# EasyEDA Pro project Xbee_v2.eprj

# Schematic Schematic1

## Sheets
1 Xbee: Board Name: Board1; Create Date: 2024-11-14; Page Name: Xbee; Project Name: Xbee_v2; Schematic Name: Schematic1; Update Date: 2024-12-07; Company: EasyEDA.com; Drawn: EasyEDA; Page Size: A4; Part Number: JLCPCB-002; Reviewed: EasyEDA; Version: V0.1
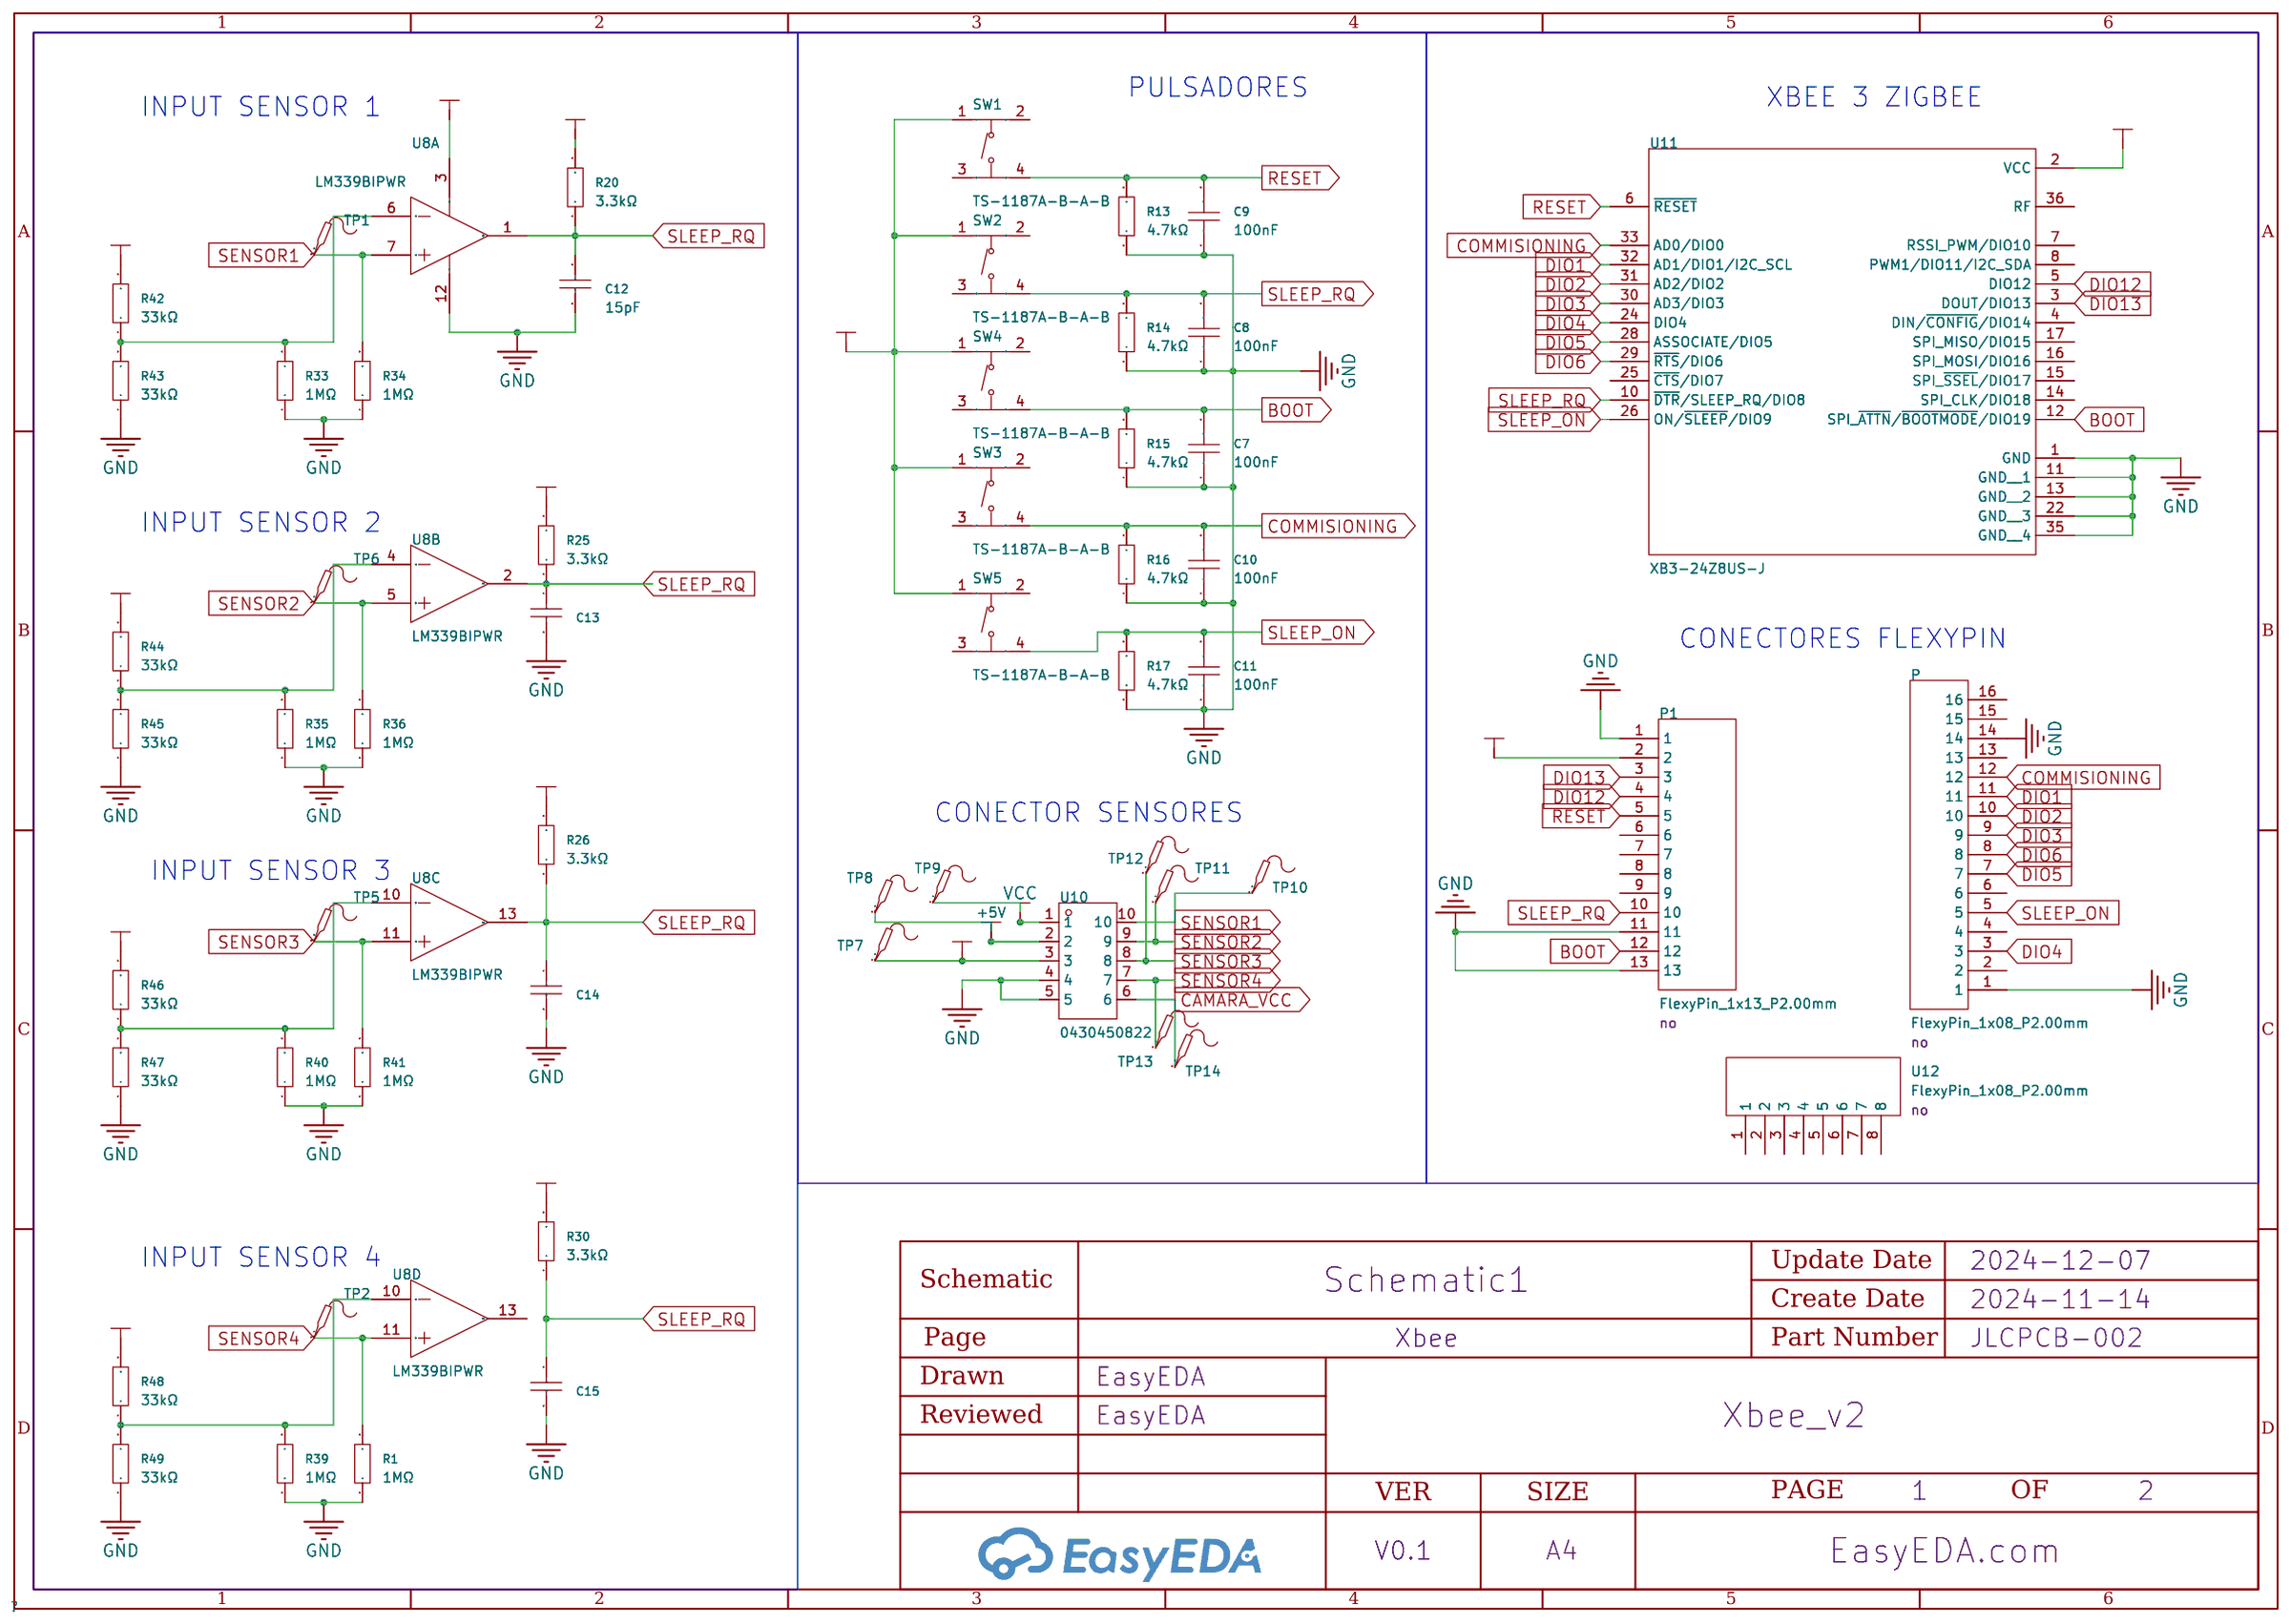
[diagram p0: Xbee]
2 Power: Create Date: 2024-11-18; Page Name: Power; Update Date: 2024-11-24
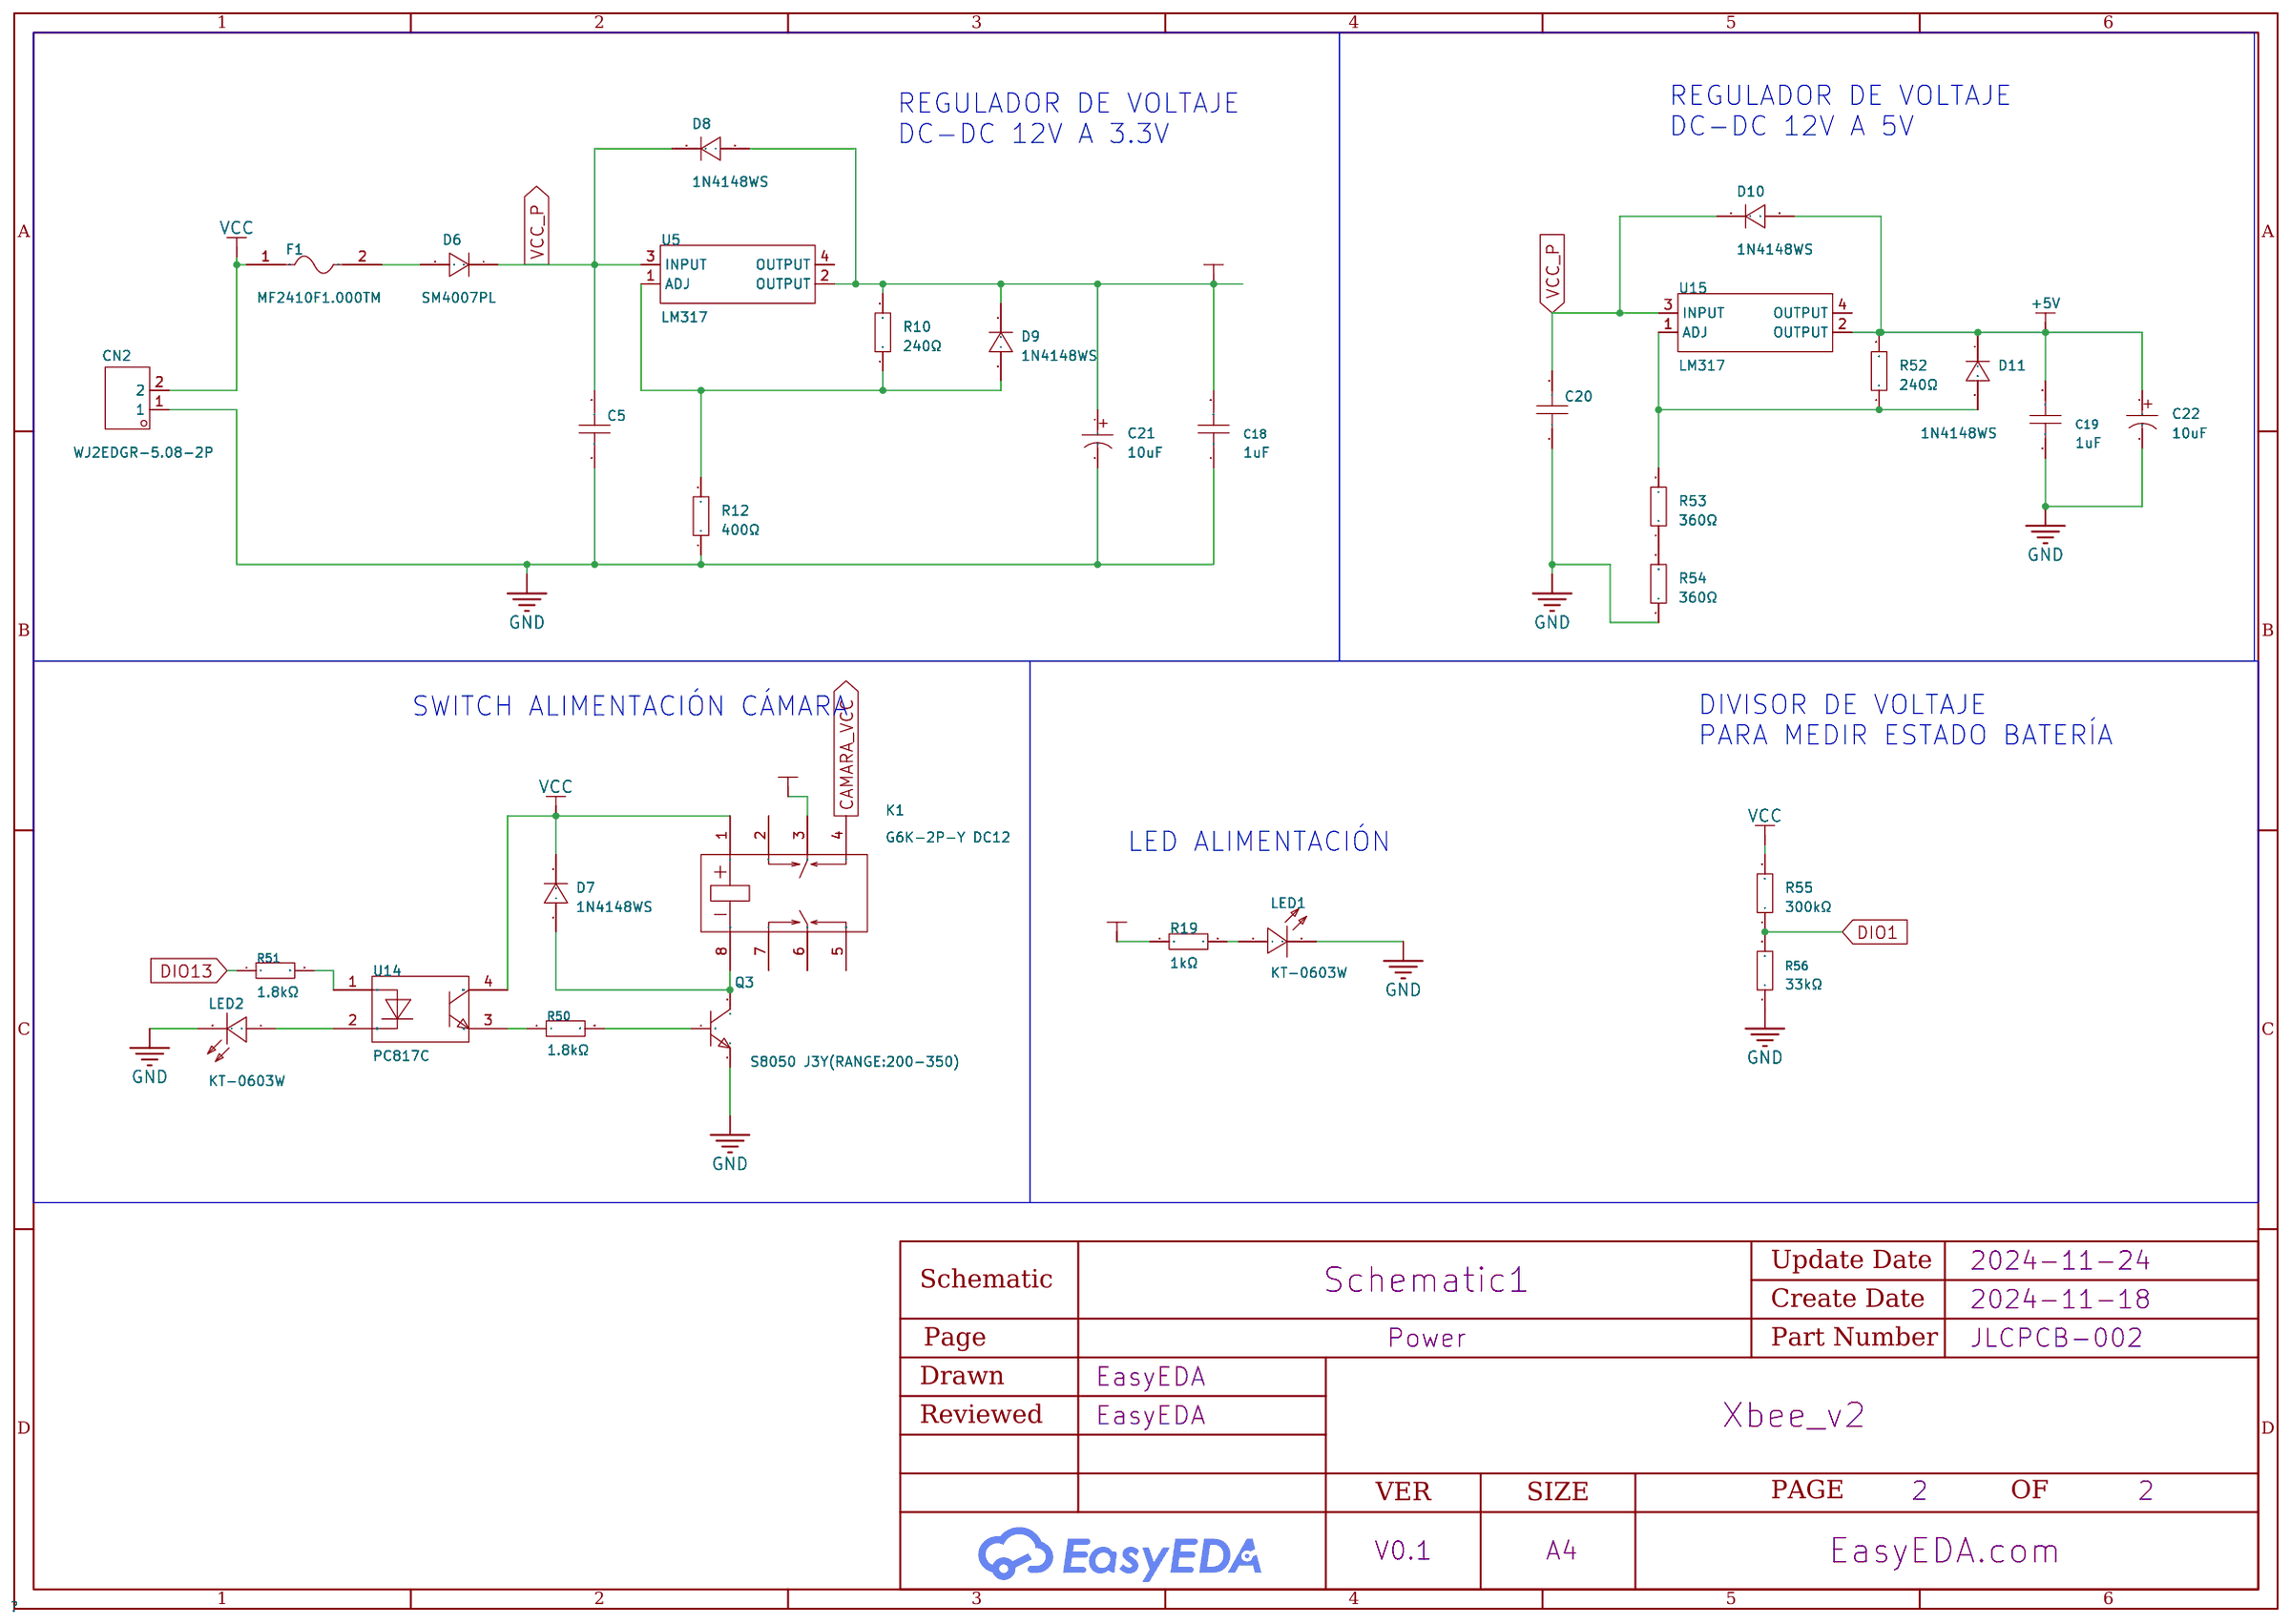
[diagram p1: Power]

## Parts
sheet Power
C5  100nF  [C0603]
C18  1uF  [C0603]
C19  1uF  [C0603]
C20  100nF  [C0603]
C21  10uF  [CAP-SMD_BD6.3-L6.6-W6.6-FD]
C22  10uF  [CAP-SMD_BD6.3-L6.6-W6.6-FD]
CN2  WJ2EDGR-5.08-2P  [CONN-TH_WJ2EDGR-5.08-2P]
D6  SM4007PL  [SOD-123F_L2.8-W1.8-LS3.7-RD]
D7  1N4148WS  [SOD-323_L1.8-W1.3-LS2.5-RD]
D8  1N4148WS  [SOD-323_L1.8-W1.3-LS2.5-RD]
D9  1N4148WS  [SOD-323_L1.8-W1.3-LS2.5-RD]
D10  1N4148WS  [SOD-323_L1.8-W1.3-LS2.5-RD]
D11  1N4148WS  [SOD-323_L1.8-W1.3-LS2.5-RD]
F1  MF2410F1.000TM  [F2410]
K1  G6K-2P-Y DC12  [RELAY-TH_6S-2-4.5VG6K-2P-Y-12V]
LED1  KT-0603W  [LED0603-R-RD_WHITE]
LED2  KT-0603W  [LED0603-R-RD_WHITE]
Q3  S8050 J3Y(RANGE:200-350)  [SOT-23-3_L3.0-W1.7-P0.95-LS2.9-BR]
R10  240Ω  [R0402]
R12  400Ω  [R0805]
R19  1kΩ  [R0603]
R50  1.8kΩ  [R0402]
R51  1.8kΩ  [R0402]
R52  240Ω  [R0402]
R53  360Ω  [R0603]
R54  360Ω  [R0603]
R55  300kΩ  [R0402]
R56  33kΩ  [R0603]
U5  LM317  [SOT-223-3_L6.7-W3.7-P2.30-LS7.0-BR]
U14  PC817C  [SMD-4_L6.5-W4.6-P2.54-LS10.3-TL]
U15  LM317  [SOT-223-3_L6.7-W3.7-P2.30-LS7.0-BR]
sheet Xbee
C7  100nF  [C0603]  (no BOM)
C8  100nF  [C0603]  (no BOM)
C9  100nF  [C0603]  (no BOM)
C10  100nF  [C0603]  (no BOM)
C11  100nF  [C0603]  (no BOM)
C12  15pF  [C0603]
C13  15pF  [C0402]
C14  15pF  [C0402]
C15  15pF  [C0402]
P  FlexyPin_1x08_P2.00mm  [FlexyPin_1x16_P2.00mm]  (no BOM)
P1  FlexyPin_1x13_P2.00mm  [FlexyPin_1x13_P2.00mm]  (no BOM)
R1  1MΩ  [R1206]
R13  4.7kΩ  [R0805]  (no BOM)
R14  4.7kΩ  [R0805]  (no BOM)
R15  4.7kΩ  [R0805]  (no BOM)
R16  4.7kΩ  [R0805]  (no BOM)
R17  4.7kΩ  [R0805]  (no BOM)
R20  3.3kΩ  [R0603]
R25  3.3kΩ  [R0603]
R26  3.3kΩ  [R0603]
R30  3.3kΩ  [R0603]
R33  1MΩ  [R1206]
R34  1MΩ  [R1206]
R35  1MΩ  [R1206]
R36  1MΩ  [R1206]
R39  1MΩ  [R1206]
R40  1MΩ  [R1206]
R41  1MΩ  [R1206]
R42  33kΩ  [R0603]
R43  33kΩ  [R0603]
R44  33kΩ  [R0603]
R45  33kΩ  [R0603]
R46  33kΩ  [R0603]
R47  33kΩ  [R0603]
R48  33kΩ  [R0603]
R49  33kΩ  [R0603]
SW1  TS-1187A-B-A-B  [SW-SMD_4P-L5.1-W5.1-P3.70-LS6.5-TL_H1.5]  (no BOM)
SW2  TS-1187A-B-A-B  [SW-SMD_4P-L5.1-W5.1-P3.70-LS6.5-TL_H1.5]  (no BOM)
SW3  TS-1187A-B-A-B  [SW-SMD_4P-L5.1-W5.1-P3.70-LS6.5-TL_H1.5]  (no BOM)
SW4  TS-1187A-B-A-B  [SW-SMD_4P-L5.1-W5.1-P3.70-LS6.5-TL_H1.5]  (no BOM)
SW5  TS-1187A-B-A-B  [SW-SMD_4P-L5.1-W5.1-P3.70-LS6.5-TL_H1.5]  (no BOM)
TP1  -  [Test-Point-0.5mm]
TP2  -  [Test-Point-0.5mm]
TP5  -  [Test-Point-0.5mm]
TP6  -  [Test-Point-0.5mm]
TP7  -  [Test-Point-0.5mm]
TP8  -  [Test-Point-0.5mm]
TP9  -  [Test-Point-0.5mm]
TP10  -  [Test-Point-0.5mm]
TP11  -  [Test-Point-0.5mm]
TP12  -  [Test-Point-0.5mm]
TP13  -  [Test-Point-0.5mm]
TP14  -  [Test-Point-0.5mm]
U8  LM339BIPWR  [TSSOP-14_L5.0-W4.4-P0.65-LS6.4-BL]  (sections 1,2,3,4)
U10  0430450822  [CONN-TH_0430450822]
U11  XB3-24Z8US-J  [XCVR_XB3-24Z8US-J]  (no BOM)
U12  FlexyPin_1x08_P2.00mm  [FlexyPin_1x08_P2.00mm]  (no BOM)

## Library data of the parts
C5 C20 = CC0603KRX7R9BB104: Capacitance: Tolerance:±10% Tolerance:±10% Voltage Rated: Temperature Coefficient:; LCSC Part Name: 100nF ±10% 50V; Supplier Part: C14663; Manufacturer: YAGEO(国巨); Supplier Footprint: 0603; JLCPCB Part Class: Basic Part; Datasheet: https://atta.szlcsc.com/upload/public/pdf/source/20180910/C282072_33301C7F631E79921B82A8DAC6BCC5B3.pdf; Supplier: LCSC; Tolerance: ±10%; Check: true
C18 C19 = CL10A105KB8NNNC: Capacitance: Tolerance:±10% Tolerance:±10% Voltage Rated: Temperature Coefficient:; LCSC Part Name: 1uF ±10% 50V; Supplier Part: C15849; Manufacturer: SAMSUNG(三星); Supplier Footprint: 0603; JLCPCB Part Class: Basic Part; Datasheet: https://atta.szlcsc.com/upload/public/pdf/source/20160218/1457707763339.pdf; Supplier: LCSC; Tolerance: ±10%
C21 C22 = RVT1H100M0605: Capacitance: Tolerance:±20% Tolerance:±20% Rated Voltage: Ripple Current:- Equivalent Series Resistance(ESR):- φD: L: Lifetime @ Temp:2000hrs@105℃ Operating Temperature:-55℃~+105℃ Operating Temperature:-55℃~+105℃; LCSC Part Name: 10uF ±20% 50V; Supplier Part: C14162; Manufacturer: HONOR(荣誉); Supplier Footprint: SMD,D6.3xL5.4mm; JLCPCB Part Class: Extended Part; Datasheet: https://atta.szlcsc.com/upload/public/pdf/source/20210521/C113284_25C86AE95FB541053FE695F13EA8E7D0.pdf; Supplier: LCSC; Tolerance: ±20%; Lifetime @ Temp: 2000hrs@105℃; Operating Temperature: -55℃~+105℃
CN2 = WJ2EDGR-5.08-2P: LCSC Part Name: 1x2P 5.08mm 排数:1 每排P数:2; Supplier Part: C8383; Manufacturer: KANGNEX(康奈克斯电气); Supplier Footprint: 弯插,P=5.08mm; JLCPCB Part Class: Extended Part; Datasheet: https://atta.szlcsc.com/upload/public/pdf/source/20191225/C8383_DE80ABD4B75356B45B295FA186A21D08.pdf; Supplier: LCSC; Connector Type: Board end/socket - Open type; Structure: 1x2P; Pitch: 5.08mm; Color: Green; Mounting Style: Bend; Number of Pins: 2P; Number of Rows: 1; Number of PINs Per Row: 2; Current Rating (Max): 20A; Voltage Rating (Max): 450V; Contact Material: Brass; Contact Plating: Tin; Operating Temperature Range: -40℃~+105℃; Check: true
D6 = SM4007PL_C64898: Diode Configuration: Forward Voltage (Vf@If):1.1V@1A Reverse Voltage (Vr): Rectified Current: Reverse Leakage Current:10uA@1kV; LCSC Part Name: 电压:1kV 电流:1A; Supplier Part: C64898; Manufacturer: MDD(辰达半导体); Supplier Footprint: SOD-123FL; JLCPCB Part Class: Basic Part; Datasheet: https://atta.szlcsc.com/upload/public/pdf/source/20230823/16A8FDE162764C9B685A3717F2DA3690.pdf; Supplier: LCSC; Forward Voltage (Vf@If): 1.1V@1A; Reverse Leakage Current: 10uA@1kV
D7-D11 = 1N4148WS_C2128: Diode Configuration:Independent Type Forward Voltage (Vf@If):1.25V@150mA Reverse Voltage (Vr): Rectified Current: Reverse Leakage Current:1uA@75V Reverse Recovery Time (trr): Operating Temperature:- Operating Temperature:-; LCSC Part Name: 电压:100V 电流:150mA; Supplier Part: C2128; Manufacturer: CJ(江苏长电/长晶); Supplier Footprint: SOD-323; JLCPCB Part Class: Basic Part; Datasheet: https://atta.szlcsc.com/upload/public/pdf/source/20140809/1457707208178.pdf; Supplier: LCSC; Diode Configuration: Independent Type; Forward Voltage (Vf@If): 1.25V@150mA; Reverse Leakage Current: 1uA@75V
F1 = MF2410F1.000TM: LCSC Part Name: 250V贴片式保险丝; Supplier Part: C83798; Manufacturer: AEM; Supplier Footprint: SMD; JLCPCB Part Class: Extended Part; Datasheet: https://atta.szlcsc.com/upload/public/pdf/source/20200908/C83798_396F0CF7AA83E8B3AAA489356853D9D1.pdf; Supplier: LCSC; Type: SMD Fuse; Current Rating: 1A; Voltage Rating  (AC): 250V; Operating Temperature: -55℃~+125℃; Breaking Capacity: 100A
K1 = G6K-2P-Y DC12: LCSC Part Name: G6K-2P-Y-12V; Supplier Part: C132367; Manufacturer: OMRON(欧姆龙); Supplier Footprint: DIP,6.5x10mm; JLCPCB Part Class: Extended Part; Datasheet: https://atta.szlcsc.com/upload/public/pdf/source/20220125/C1876770_53E5491D4B68F29C4BBD8118E9BAE0E8.pdf; Supplier: LCSC; Coil Voltage: 12V; Contact Form: 两组转换:2C(DPDT-转换); Maximum Switching Voltage: 125V@AC；60V@DC; Contact Material: silver+Gold plating; Maximum Switching Current: 1A; Operate Time: 3ms; Release Time: 3ms; Operating Temperature: -40℃~+70℃
LED1 LED2 = KT-0603W: LCSC Part Name: 0603 白灯 高亮; Supplier Part: C2290; Manufacturer: KENTO; Supplier Footprint: 0603; JLCPCB Part Class: Basic Part; Datasheet: https://atta.szlcsc.com/upload/public/pdf/source/20221101/4C23D5C85BA051E44A00B833D0A41468.pdf; Supplier: LCSC; Emitted Color: White
Q3 = S8050 J3Y(RANGE:200-350): LCSC Part Name: NPN 电流:500mA 耐压:25V H档(200-350); Supplier Part: C2146; Manufacturer: CJ(江苏长电/长晶); Supplier Footprint: SOT-23; JLCPCB Part Class: Basic Part; Datasheet: https://atta.szlcsc.com/upload/public/pdf/source/20231013/FF37B6A000E6CDA75C9C999D2E78731F.pdf; Supplier: LCSC; DC Current Gain (hFE@Ic,Vce): 200@500mA,1V; Transition Frequency (fT): 150MHz; Collector Cut-Off Current (Icbo): 100nA; Collector-Emitter Saturation Voltage (VCE(sat)@Ic,Ib): 600mV@500mA,50mA; Operating Temperature: -55℃~+150℃
R10 R52 = RC0402FR-07240RL: LCSC Part Name: 厚膜电阻 240Ω ±1% 62.5mW; Supplier Part: C114755; Manufacturer: YAGEO(国巨); Supplier Footprint: 0402; JLCPCB Part Class: Extended Part; Datasheet: https://atta.szlcsc.com/upload/public/pdf/source/20180821/C275644_0D56F95EFF785E7D9A1FEF436B37DA78.pdf; Supplier: LCSC; Type: Thick Film Resistors; Tolerance: ±1%; Temperature Coefficient: ±100ppm/℃; Operating Temperature Range: -55℃~+155℃; Check: true
R12 = TR0805B400RP0525Z: Type:Thin Film Resistor Resistance: Tolerance:±0.1% Tolerance:±0.1% Power(Watts): Overload Voltage (Max): Temperature Coefficient:±25ppm/℃ Temperature Coefficient:±25ppm/℃ Operating Temperature Range:-55℃~+155℃ Operating Temperature Range:-55℃~+155℃; LCSC Part Name: 薄膜电阻 400Ω ±0.1% 125mW; Supplier Part: C153298; Manufacturer: EVER OHMS(天二科技); Supplier Footprint: 0805; JLCPCB Part Class: Extended Part; Datasheet: https://atta.szlcsc.com/upload/public/pdf/source/20190527/C149900_32B1354086E9F6A772108AB7B2B7A514.pdf; Supplier: LCSC; Type: Thin Film Resistor; Tolerance: ±0.1%; Temperature Coefficient: ±25ppm/℃; Operating Temperature Range: -55℃~+155℃
R19 = 0603WAF1001T5E: LCSC Part Name: 1kΩ ±1% 100mW 厚膜电阻; Supplier Part: C21190; Manufacturer: UNI-ROYAL(厚声); Supplier Footprint: 0603; JLCPCB Part Class: Basic Part; Datasheet: https://atta.szlcsc.com/upload/public/pdf/source/20200306/C422600_1E6D84923E4A46A82E41ADD87F860B5C.pdf; Supplier: LCSC; Type: Thick Film Resistors; Tolerance: ±1%; Temperature Coefficient: ±100ppm/℃; Operating Temperature Range: -55℃~+155℃
R50 R51 = 0402WGF1801TCE: LCSC Part Name: 1.8kΩ ±1% 62.5mW 厚膜电阻; Supplier Part: C25871; Manufacturer: UNI-ROYAL(厚声); Supplier Footprint: 0402; JLCPCB Part Class: Extended Part; Datasheet: https://atta.szlcsc.com/upload/public/pdf/source/20200306/C422600_1E6D84923E4A46A82E41ADD87F860B5C.pdf; Supplier: LCSC; Type: Thick Film Resistors; Tolerance: ±1%; Temperature Coefficient: ±100ppm/℃; Operating Temperature Range: -55℃~+155℃
R53 R54 = RC0603FR-07360RL: LCSC Part Name: 厚膜电阻 360Ω ±1% 100mW; Supplier Part: C137739; Manufacturer: YAGEO(国巨); Supplier Footprint: 0603; JLCPCB Part Class: Extended Part; Datasheet: https://atta.szlcsc.com/upload/public/pdf/source/20180821/C275644_0D56F95EFF785E7D9A1FEF436B37DA78.pdf; Supplier: LCSC; Type: Thick Film Resistors; Tolerance: ±1%; Temperature Coefficient: ±100ppm/℃; Operating Temperature Range: -55℃~+155℃
R55 = 0402WGF3003TCE: LCSC Part Name: 300kΩ ±1% 62.5mW 厚膜电阻; Supplier Part: C25774; Manufacturer: UNI-ROYAL(厚声); Supplier Footprint: 0402; JLCPCB Part Class: Extended Part; Datasheet: https://atta.szlcsc.com/upload/public/pdf/source/20200306/C422600_1E6D84923E4A46A82E41ADD87F860B5C.pdf; Supplier: LCSC; Type: Thick Film Resistors; Tolerance: ±1%; Temperature Coefficient: ±100ppm/℃; Operating Temperature Range: -55℃~+155℃
R42-R49 R56 = 0603WAF3302T5E: LCSC Part Name: 33kΩ ±1% 100mW 厚膜电阻; Supplier Part: C4216; Manufacturer: UNI-ROYAL(厚声); Supplier Footprint: 0603; JLCPCB Part Class: Basic Part; Datasheet: https://atta.szlcsc.com/upload/public/pdf/source/20200306/C422600_1E6D84923E4A46A82E41ADD87F860B5C.pdf; Supplier: LCSC; Type: Thick Film Resistors; Tolerance: ±1%; Temperature Coefficient: ±100ppm/℃; Operating Temperature Range: -55℃~+155℃
U5 U15 = LM317_C7543014: LCSC Part Name: ADJ 输入40V 输出1.2V~37V 1.5A; Supplier Part: C7543014; Manufacturer: HXY MOSFET(华轩阳电子); Supplier Footprint: SOT-223; JLCPCB Part Class: Extended Part; Datasheet: https://atta.szlcsc.com/upload/public/pdf/source/20240523/5EE7B31F0BBF1ABA5627560C7CA7F030.pdf; Supplier: LCSC; Output Type: 可调; Maximum Input Voltage: 40V; Output Voltage: 1.2V~37V; MAX Output Current: 2.2A; Output Polarity: Positive electrode; Number of Outputs: 1; Check: true
U14 = PC817C_C5451663: LCSC Part Name: 光电晶体管输出 C档 C档; Supplier Part: C5451663; Manufacturer: HXY MOSFET(华轩阳电子); Supplier Footprint: SMD-4; JLCPCB Part Class: Extended Part; Datasheet: https://atta.szlcsc.com/upload/public/pdf/source/20230427/2D3E47F01143E2C21095E32F53157FE2.pdf; Supplier: LCSC; Input voltage type: DC; Output Type: 光电三极管; Forward Voltage: 1.2V; Output Current: 50mA; Reverse Voltage: 6V; Receiving End Voltage: 35V; Number of Outputs: 1; Collector-Emitter Saturation Voltage (Vce(sat)@Ic,IF): 200mV; Rise time: 18us; Fall time: 18us
C7-C11 = CC0603KRX7R9BB104: LCSC Part Name: 100nF ±10% 50V; Supplier Part: C14663; Manufacturer: YAGEO(国巨); Supplier Footprint: 0603; JLCPCB Part Class: Basic Part; Datasheet: https://atta.szlcsc.com/upload/public/pdf/source/20180910/C282072_33301C7F631E79921B82A8DAC6BCC5B3.pdf; Supplier: LCSC; Tolerance: ±10%; Check: true
C12 = CC0603JRNPO9BN150: LCSC Part Name: 15pF ±5% 50V; Supplier Part: C107037; Manufacturer: YAGEO(国巨); Supplier Footprint: 0603; JLCPCB Part Class: Extended Part; Datasheet: https://atta.szlcsc.com/upload/public/pdf/source/20170914/C128857_1505359892143968080.pdf; Supplier: LCSC; Tolerance: ±5%
C13-C15 = 0402CG150J500NT: Capacitance: Tolerance:±5% Tolerance:±5% Voltage Rated: Temperature Coefficient:; LCSC Part Name: 15pF ±5% 50V; Supplier Part: C1548; Manufacturer: FH(风华); Supplier Footprint: 0402; JLCPCB Part Class: Basic Part; Datasheet: https://atta.szlcsc.com/upload/public/pdf/source/20200305/C486355_26A10D38EF8C2A5C37091D0039909270.pdf; Supplier: LCSC; Tolerance: ±5%
P = FlexyPin_1x16_P2.00mm: Check: false
P1 = FlexyPin_1x13_P2.00mm: Check: false
R1 R33-R36 R39-R41 = 1206W4F1004T5E: LCSC Part Name: 1MΩ ±1% 250mW 厚膜电阻; Supplier Part: C17927; Manufacturer: UNI-ROYAL(厚声); Supplier Footprint: 1206; JLCPCB Part Class: Basic Part; Datasheet: https://atta.szlcsc.com/upload/public/pdf/source/20200306/C422600_1E6D84923E4A46A82E41ADD87F860B5C.pdf; Supplier: LCSC; Type: Thick Film Resistors; Tolerance: ±1%; Temperature Coefficient: ±100ppm/℃; Operating Temperature Range: -55℃~+155℃
R13-R17 = 0805W8F4701T5E: LCSC Part Name: 4.7kΩ ±1% 125mW 厚膜电阻; Supplier Part: C17673; Manufacturer: UNI-ROYAL(厚声); Supplier Footprint: 0805; JLCPCB Part Class: Basic Part; Datasheet: https://atta.szlcsc.com/upload/public/pdf/source/20200306/C422600_1E6D84923E4A46A82E41ADD87F860B5C.pdf; Supplier: LCSC; Type: Thick Film Resistors; Tolerance: ±1%; Temperature Coefficient: ±100ppm/℃; Operating Temperature Range: -55℃~+155℃
R20 R25 R26 R30 = 0603WAF3301T5E: LCSC Part Name: 3.3kΩ ±1% 100mW 厚膜电阻; Supplier Part: C22978; Manufacturer: UNI-ROYAL(厚声); Supplier Footprint: 0603; JLCPCB Part Class: Basic Part; Datasheet: https://atta.szlcsc.com/upload/public/pdf/source/20200306/C422600_1E6D84923E4A46A82E41ADD87F860B5C.pdf; Supplier: LCSC; Type: Thick Film Resistors; Tolerance: ±1%; Temperature Coefficient: ±100ppm/℃; Operating Temperature Range: -55℃~+155℃
SW1-SW5 = TS-1187A-B-A-B: LCSC Part Name: 5.1*5.1*1.5mm 立贴 轻触开关; Supplier Part: C318884; Manufacturer: XKB Connectivity(中国星坤); Supplier Footprint: SMD; JLCPCB Part Class: Basic Part; Datasheet: https://atta.szlcsc.com/upload/public/pdf/source/20200227/C318890_053E50208A88A7BA1965D8746000774E.pdf; Supplier: LCSC; Circuit: SPST; Actuator Style: Round Button; Operating Force: 160gf; Mounting Style: Brick nogging; Switch Length: 5.1mm; Switch Width: 5.1mm; Switch Height: 1.5mm; Strike Gundam: 不带; Contact Current: 50mA; Voltage Rating (DC): 12V; Actuator/Cap Color: 金色; With Lamp: No; Mechanical Life: 10万次; Operating Temperature: -30℃~+85℃; Check: true
TP1 TP2 TP5-TP14 = Test-Point: Check: false
U8 = LM339BIPWR: Supplier Part: C7430196; Manufacturer: TI(德州仪器); Supplier Footprint: TSSOP-14; JLCPCB Part Class: Extended Part; Datasheet: https://atta.szlcsc.com/upload/public/pdf/source/20230810/1B1BCF8EE7E9C6AF73251D1269C27114.pdf; Supplier: LCSC
U10 = 0430450822: LCSC Part Name: 2x4P 间距:3mm 弯插 系列:Micro-Fit(MX 3.0); Supplier Part: C17304087; Manufacturer: MOLEX; Supplier Footprint: 弯插; JLCPCB Part Class: Extended Part; Supplier: LCSC; Pins Structure: 2x4P; Pitch: 3mm; Mounting Style: Bend insert; Reference Series: Micro-Fit(MX 3.0); Number of Pins: 8P; Number of Rows: 2; Number of PINs Per Row: 4; Row Spacing: 3mm; Current Rating (Max): 8.5A; Contact Material: Brass; Contact Plating: Gold; Operating Temperature Range: -40℃~+105℃; Rated Voltage (Max): 600V; Flame Retardant Rating: UL94V-0; Supplementary Features: Harpoon foot (metal)；Auxiliary soldering legs; Colour: Black; Z-Height of the Board: 8.8mm; X-Length of Bottom Edge on Board (Spacing Line): 15.65mm; Y-Width of Bottom Edge on Board: 12.24mm
U11 = XB3-24Z8US-J
U12 = FlexyPin_1x08_P2.00mm: Check: false

## Nets
+3.3V: C18.2 C21.1 D8.2(A) D9.1(K) K1.3 P1.2 R10.2 R19.1 R20.2 R25.2 R26.2 R30.2 R42.2 R44.2 R46.2 R48.2 SW1.1(A) SW2.1(A) SW3.1(A) SW4.1(A) SW5.1(A) TP7.1 U5.2(OUTPUT) U8.3(VCC) U10.3 U11.2(VCC)
+5V: C19.2 C22.1 D10.2(A) D11.1(K) R52.2 TP8.1 U10.2 U15.2(OUTPUT)
GND: C5.1 C7.1 C8.1 C9.1 C10.1 C11.1 C12.2 C13.2 C14.2 C15.2 C18.1 C19.1 C20.1 C21.2 C22.2 CN2.1 LED1.2(K) LED2.2(K) P.1 P.14 P1.1 P1.11 P1.13 Q3.2(E) R1.1 R12.1 R13.1 R14.1 R15.1 R16.1 R17.1 R33.1 R34.1 R35.1 R36.1 R39.1 R40.1 R41.1 R43.1 R45.1 R47.1 R49.1 R54.1 R56.1 U8.12(GND) U10.4 U10.5 U11.1(GND) U11.11(GND__1) U11.13(GND__2) U11.22(GND__3) U11.35(GND__4)
VCC: CN2.2 D7.1(K) F1.1 K1.1 R55.2 TP9.1 U10.1 U14.4(Collector)
VCC_P: C5.2 C20.2 D6.1(C) D8.1(K) D10.1(K) U5.3(INPUT) U15.3(INPUT)
BOOT: C7.2 P1.12 R15.2 SW4.4(D) U11.12(SPI_~{ATTN}/~{BOOTMODE}/DIO19)
CAMARA_VCC: K1.4 TP14.1 U10.6
COMMISIONING: C10.2 P.12 R16.2 SW3.4(D) U11.33(AD0/DIO0)
DIO1: P.11 R55.1 R56.2 U11.32(AD1/DIO1/I2C_SCL)
DIO2: P.10 U11.31(AD2/DIO2)
DIO3: P.9 U11.30(AD3/DIO3)
DIO4: P.3 U11.24(DIO4)
DIO5: P.7 U11.28(ASSOCIATE/DIO5)
DIO6: P.8 U11.29(~{RTS}/DIO6)
DIO12: P1.4 U11.5(DIO12)
DIO13: P1.3 R51.1 U11.3(DOUT/DIO13)
RESET: C9.2 P1.5 R13.2 SW1.4(D) U11.6(~{RESET})
SENSOR1: R34.2 TP1.1 TP10.1 U8.7(IN1+) U10.10
SENSOR2: R36.2 TP6.1 TP11.1 U8.5(IN2+) U10.9
SENSOR3: R1.2 R41.2 TP2.1 TP5.1 TP12.1 TP13.1 U8.11(IN4+) U10.7 U10.8
SLEEP_ON: C11.2 P.5 R17.2 SW5.4(D) U11.26(ON/~{SLEEP}/DIO9)
SLEEP_RQ: C8.2 C12.1 C13.1 C14.1 C15.1 P1.10 R14.2 R20.1 R25.1 R26.1 R30.1 SW2.4(D) U8.1(OUT1) U8.2(OUT2) U8.13(OUT4) U11.10(~{DTR}/SLEEP_RQ/DIO8)
$1N9776: R33.2 R42.1 R43.2 U8.6(IN1-)
$1N10309: R35.2 R44.1 R45.2 U8.4(IN2-)
$2N484: D9.2(A) R10.1 R12.2 U5.1(ADJ)
$2N770: LED1.1(A) R19.2
$2N3060: R51.2 U14.1(Anode)
$2N3062: Q3.1(B) R50.2
$2N3068: R50.1 U14.3(Emitter)
$2N3229: LED2.1(A) U14.2(Cathode)
$2N3351: D7.2(A) K1.8 Q3.3(C)
$2N4261: D6.2(A) F1.2
$2N4985: D11.2(A) R52.1 R53.2 U15.1(ADJ)
$2N8186: R53.1 R54.2
Net-(R39-2): R39.2 R40.2 R46.1 R47.2 R48.1 R49.2 U8.10(IN4-)

Not connected (* = marked no-connect by the designer): K1 2 5 6 7; P 2 4 6 13 15 16; P1 6 7 8 9; SW1 2(B) 3(C); SW2 2(B) 3(C); SW3 2(B) 3(C); SW4 2(B) 3(C); SW5 2(B) 3(C); U5 4(OUTPUT); U11 4(DIN/~{CONFIG}/DIO14) 7(RSSI_PWM/DIO10) 8(PWM1/DIO11/I2C_SDA) 14(SPI_CLK/DIO18) 15(SPI_~{SSEL}/DIO17) 16(SPI_MOSI/DIO16) 17(SPI_MISO/DIO15) 25(~{CTS}/DIO7) 36(RF); U12 1 2 3 4 5 6 7 8; U15 4(OUTPUT)

## Notes on the sheets
sheet 1
- PULSADORES
- XBEE 3 ZIGBEE
- INPUT SENSOR 1
- INPUT SENSOR 2
- CONECTORES FLEXYPIN
- CONECTOR SENSORES
- INPUT SENSOR 3
- INPUT SENSOR 4
sheet 2
- REGULADOR DE VOLTAJE
  DC-DC 12V A 3.3V
- REGULADOR DE VOLTAJE
  DC-DC 12V A 5V
- SWITCH ALIMENTACIÓN CÁMARA
- DIVISOR DE VOLTAJE
  PARA MEDIR ESTADO BATERÍA
- LED ALIMENTACIÓN

# Board PCB1
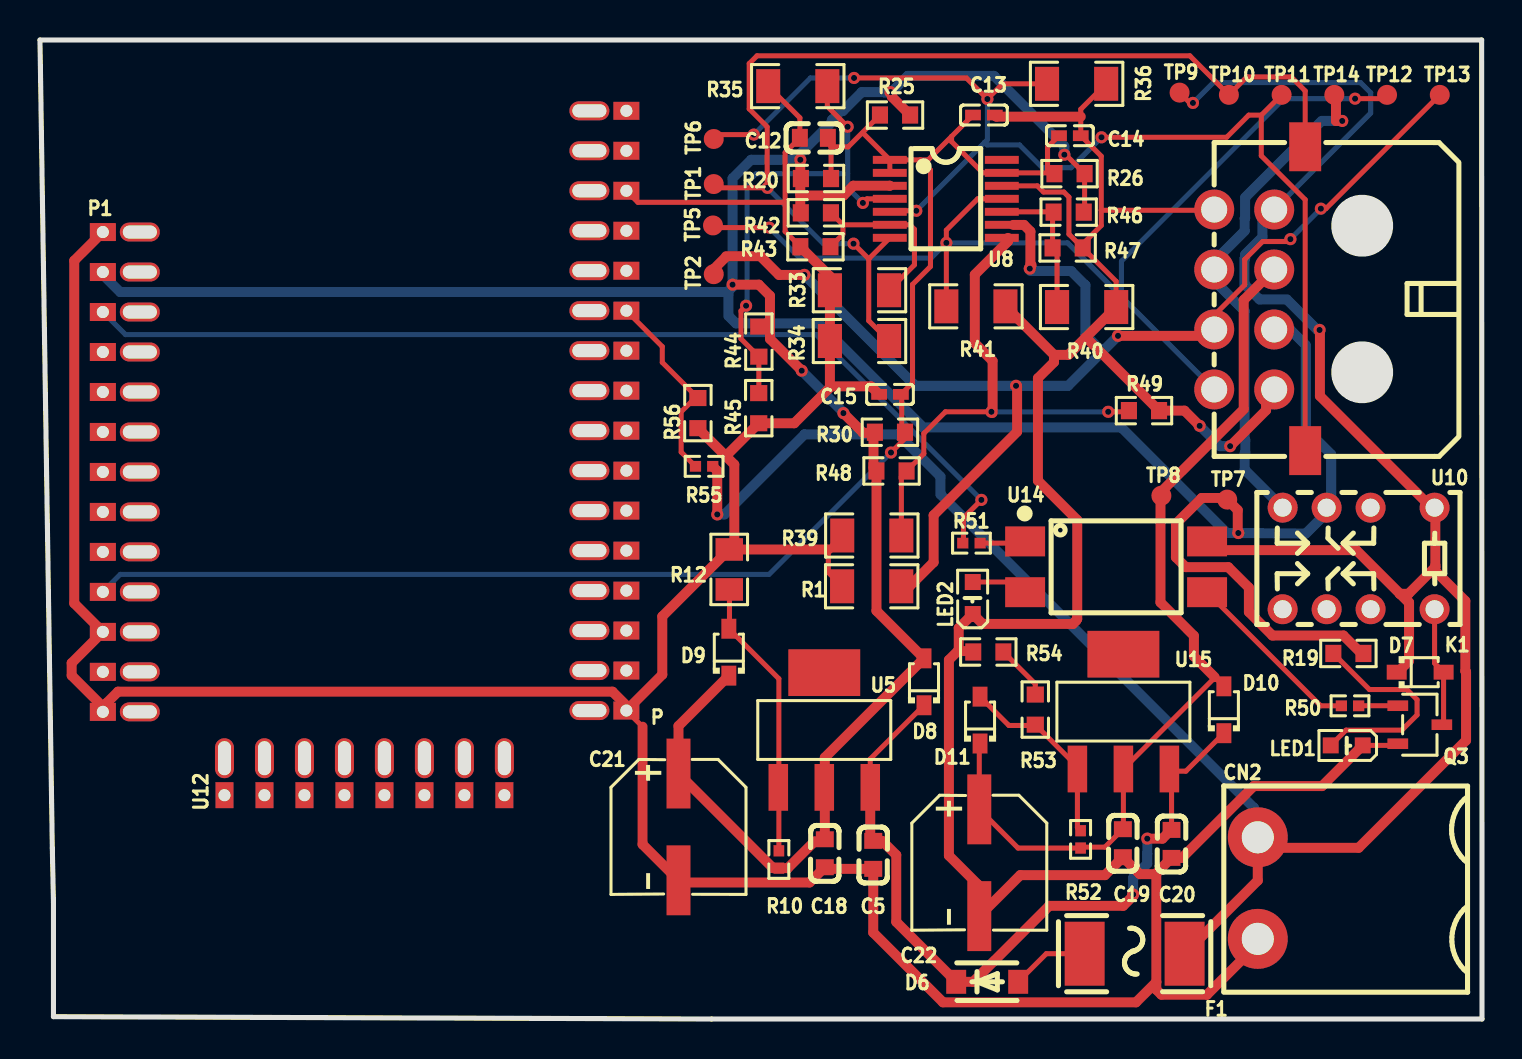
[diagram p2: board, top side]
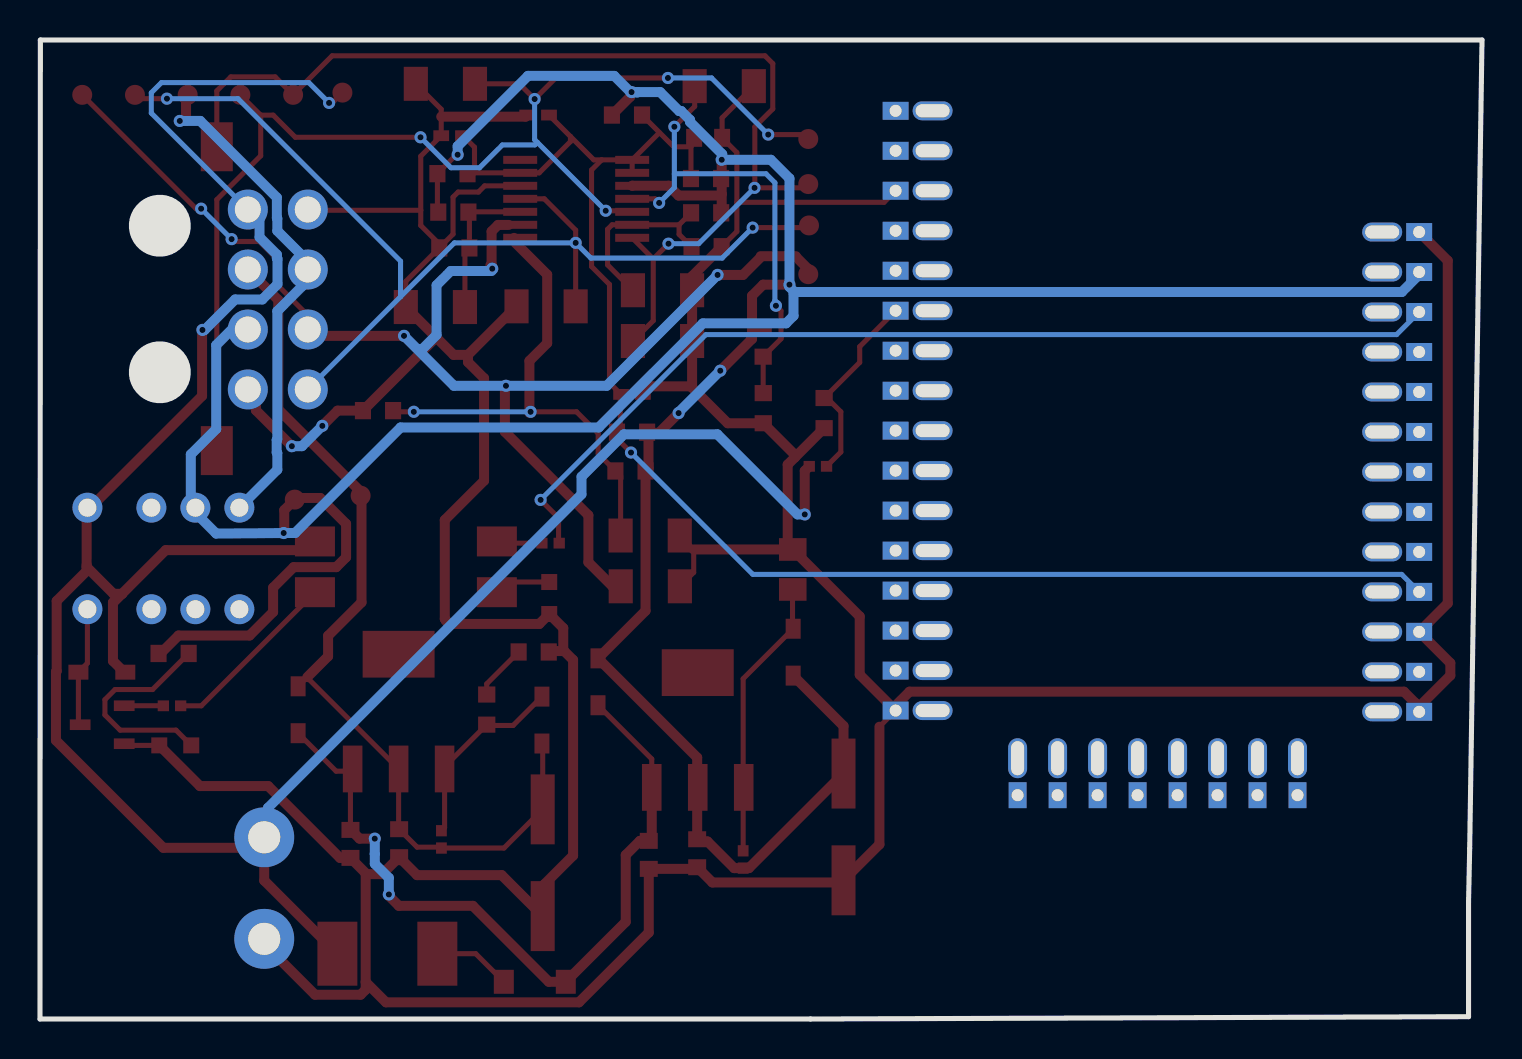
[diagram p3: board, bottom side, seen from below]

Outline 72.12 x 48.97 mm; copper layers: Top Layer, Bottom Layer. Coordinates in mm from the lower left corner of the outline.
Outline path: 0,48.97 72.11,48.97 72.12,0 33.59,0 0.67,0.12 0.67,5.84 0.62,8.55 0,48.97
Stack: Top Layer 0.035mm / Dielectric1 1.51mm FR4 er 4.5 / Bottom Layer 0.035mm

## Design rules (mm)
template: Custom Config
spacing copperThickness1oz: track to track 0.102, other pairs 0.152 to 0.3
spacing copperThickness2oz (default): track to track 0.102, other pairs 0.152 to 0.3
track width copperThickness1oz (default): min 0.102, default 0.254, max 5
track width copperThickness2oz: min 0.203, default 0.254, max 2.54
differential pair differentialPair (default): width min 0.127, default 0.254, max 2.54; gap min 0.152, default 0.152
via viaSize (default): diameter min 0.5, default 0.61, max 10; hole min 0.3, default 0.305, max 6.3

## Placement (name value [footprint] x y rotation side)
C5  100nF  [C0603]  41.68 8.21 90 top
C12  15pF  [C0603]  38.71 44.08 180 top
C13  15pF  [C0402]  47.21 45.22 0 top
C14  15pF  [C0402]  51.51 44.18 0 top
C15  15pF  [C0402]  42.52 31.24 180 top
C18  1uF  [C0603]  39.25 8.29 90 top
C19  1uF  [C0603]  54.16 8.8 90 top
C20  100nF  [C0603]  56.6 8.76 90 top
C21  10uF  [CAP-SMD_BD6.3-L6.6-W6.6-FD]  31.93 9.61 270 top
C22  10uF  [CAP-SMD_BD6.3-L6.6-W6.6-FD]  46.98 7.82 270 top
CN2  WJ2EDGR-5.08-2P  [CONN-TH_WJ2EDGR-5.08-2P]  60.91 6.55 90 top
D6  SM4007PL  [SOD-123F_L2.8-W1.8-LS3.7-RD]  47.38 1.86 0 top
D7  1N4148WS  [SOD-323_L1.8-W1.3-LS2.5-RD]  69.03 17.35 0 top
D8  1N4148WS  [SOD-323_L1.8-W1.3-LS2.5-RD]  44.22 16.87 90 top
D9  1N4148WS  [SOD-323_L1.8-W1.3-LS2.5-RD]  34.45 18.35 90 top
D10  1N4148WS  [SOD-323_L1.8-W1.3-LS2.5-RD]  59.21 15.47 90 top
D11  1N4148WS  [SOD-323_L1.8-W1.3-LS2.5-RD]  47.02 14.95 90 top
F1  MF2410F1.000TM  [F2410]  54.75 3.27 180 top
K1  G6K-2P-Y DC12  [RELAY-TH_6S-2-4.5VG6K-2P-Y-12V]  65.95 23.04 180 top
LED1  KT-0603W  [LED0603-R-RD_WHITE]  65.36 13.69 180 top
LED2  KT-0603W  [LED0603-R-RD_WHITE]  46.65 21.06 90 top
P  FlexyPin_1x08_P2.00mm  [FlexyPin_1x16_P2.00mm]  29.03 15.43 180 top
P1  -  [FlexyPin_1x13_P2.00mm]  3.44 39.37 0 top
Q3  S8050 J3Y(RANGE:200-350)  [SOT-23-3_L3.0-W1.7-P0.95-LS2.9-BR]  69.01 14.72 180 top
R1  1MΩ  [R1206]  41.6 21.64 0 top
R10  240Ω  [R0402]  36.95 7.98 270 top
R12  400Ω  [R0805]  34.47 22.49 270 top
R19  1kΩ  [R0603]  65.44 18.29 180 top
R20  3.3kΩ  [R0603]  38.81 42.04 180 top
R25  3.3kΩ  [R0603]  42.77 45.22 0 top
R26  3.3kΩ  [R0603]  51.49 42.29 0 top
R30  3.3kΩ  [R0603]  42.51 29.35 180 top
R33  1MΩ  [R1206]  40.99 36.45 0 top
R34  1MΩ  [R1206]  40.99 33.91 0 top
R35  1MΩ  [R1206]  37.9 46.66 0 top
R36  1MΩ  [R1206]  51.85 46.78 180 top
R39  1MΩ  [R1206]  41.6 24.19 0 top
R40  1MΩ  [R1206]  52.35 35.61 180 top
R41  1MΩ  [R1206]  46.81 35.65 180 top
R42  33kΩ  [R0603]  38.81 40.33 180 top
R43  33kΩ  [R0603]  38.78 38.63 0 top
R44  33kΩ  [R0603]  35.95 33.88 90 top
R45  33kΩ  [R0603]  35.95 30.55 90 top
R46  33kΩ  [R0603]  51.45 40.36 0 top
R47  33kΩ  [R0603]  51.4 38.57 180 top
R48  33kΩ  [R0603]  42.59 27.41 180 top
R49  33kΩ  [R0603]  55.22 30.43 180 top
R50  1.8kΩ  [R0402]  65.52 15.67 0 top
R51  1.8kΩ  [R0402]  46.59 23.8 0 top
R52  240Ω  [R0402]  52.05 8.99 270 top
R53  360Ω  [R0603]  49.78 15.48 270 top
R54  360Ω  [R0603]  47.43 18.36 0 top
R55  300kΩ  [R0402]  33.22 27.65 0 top
R56  33kΩ  [R0603]  32.91 30.31 90 top
TP1  -  [Test-Point-0.5mm]  33.7 41.77 90 top
TP2  -  [Test-Point-0.5mm]  33.7 37.26 90 top
TP5  -  [Test-Point-0.5mm]  33.66 39.7 90 top
TP6  -  [Test-Point-0.5mm]  33.7 44.02 90 top
TP7  -  [Test-Point-0.5mm]  59.38 25.98 0 top
TP8  -  [Test-Point-0.5mm]  56.09 26.18 0 top
TP9  -  [Test-Point-0.5mm]  57 46.34 0 top
TP10  -  [Test-Point-0.5mm]  59.46 46.23 0 top
TP11  -  [Test-Point-0.5mm]  62.1 46.23 0 top
TP12  -  [Test-Point-0.5mm]  67.38 46.23 0 top
TP13  -  [Test-Point-0.5mm]  70.01 46.23 0 top
TP14  -  [Test-Point-0.5mm]  64.74 46.23 0 top
U5  LM317  [SOT-223-3_L6.7-W3.7-P2.30-LS7.0-BR]  39.23 14.46 270 top
U8  LM339BIPWR  [TSSOP-14_L5.0-W4.4-P0.65-LS6.4-BL]  45.31 41.03 270 top
U10  0430450822  [CONN-TH_0430450822]  61.01 36.03 90 top
U12  -  [FlexyPin_1x08_P2.00mm]  9.23 11.5 90 top
U14  PC817C  [SMD-4_L6.5-W4.6-P2.54-LS10.3-TL]  53.82 22.62 0 top
U15  LM317  [SOT-223-3_L6.7-W3.7-P2.30-LS7.0-BR]  54.19 15.38 270 top

## Footprints (pads in the part's own frame, mm; a bottom-side part is the same pattern mirrored in y, then rotated)
C0402
  rect 0.79x0.54 smd: 1(-0.545,0) 2(0.545,0)
C0603
  rect 0.8x0.9 smd: 1(-0.7,0) 2(0.7,0)
CAP-SMD_BD6.3-L6.6-W6.6-FD
  rect 3.5x1.2 smd: 1(-2.67,0) 2(2.67,0)
CONN-TH_0430450822
  round 2 hole 1.3: 1(4.459,-0.725) 2(1.46,-0.725) 3(-1.54,-0.725) 4(-4.54,-0.725) 5(4.459,2.275) 6(1.46,2.275) 7(-1.54,2.275) 8(-4.54,2.275)
  rect 2.45x1.6 smd: 9(-7.6,-2.275) 10(7.6,-2.275)
CONN-TH_WJ2EDGR-5.08-2P
  round 3 hole 1.6: 1(-2.54,0) 2(2.54,0)
F2410
  rect 2x3.2 smd: 1(-2.5,0) 2(2.5,0)
FlexyPin_1x08_P2.00mm
  oval 2x0.95 hole 1.7x0.65: (1.55,0) (1.55,-2) (1.55,-4) (1.55,-6) (1.55,-8) (1.55,-10) (1.55,-12) (1.55,-14)
  rect 1.3x0.9 hole 0.6: 1(-0.3,0) 2(-0.3,-2) 3(-0.3,-4) 4(-0.3,-6) 5(-0.3,-8) 6(-0.3,-10) 7(-0.3,-12) 8(-0.3,-14)
FlexyPin_1x13_P2.00mm
  oval 2x0.95 hole 1.7x0.65: (1.55,0) (1.55,-2) (1.55,-4) (1.55,-6) (1.55,-8) (1.55,-10) (1.55,-12) (1.55,-14) (1.55,-16) (1.55,-18) (1.55,-20) (1.55,-22) (1.55,-24)
  rect 1.3x0.9 hole 0.6: 1(-0.3,0) 2(-0.3,-2) 3(-0.3,-4) 4(-0.3,-6) 5(-0.3,-8) 6(-0.3,-10) 7(-0.3,-12) 8(-0.3,-14) 9(-0.3,-16) 10(-0.3,-18) 11(-0.3,-20) 12(-0.3,-22) 13(-0.3,-24)
FlexyPin_1x16_P2.00mm
  oval 2x0.95 hole 1.7x0.65: (1.55,0) (1.55,-2) (1.55,-4) (1.55,-6) (1.55,-8) (1.55,-10) (1.55,-12) (1.55,-14) (1.55,-16) (1.55,-18) (1.55,-20) (1.55,-22) (1.55,-24) (1.55,-26) (1.55,-28) (1.55,-30)
  rect 1.3x0.9 hole 0.6: 1(-0.3,0) 2(-0.3,-2) 3(-0.3,-4) 4(-0.3,-6) 5(-0.3,-8) 6(-0.3,-10) 7(-0.3,-12) 8(-0.3,-14) 9(-0.3,-16) 10(-0.3,-18) 11(-0.3,-20) 12(-0.3,-22) 13(-0.3,-24) 14(-0.3,-26) 15(-0.3,-28) 16(-0.3,-30)
LED0603-R-RD_WHITE
  rect 0.8x0.8 smd: 1(0.8,0) 2(-0.8,0)
R0402
  rect 0.566x0.54 smd: 1(-0.433,0) 2(0.433,0)
R0603
  rect 0.806x0.864 smd: 1(-0.753,0) 2(0.753,0)
R0805
  rect 1.133x1.377 smd: 1(-1,0) 2(1,0)
R1206
  rect 1.208x1.701 smd: 1(-1.479,0) 2(1.479,0)
RELAY-TH_6S-2-4.5VG6K-2P-Y-12V
  round 1.5 hole 0.9: 1(-3.8,-2.54) 2(-0.6,-2.54) 3(1.6,-2.54) 4(3.8,-2.54) 5(3.8,2.54) 6(1.6,2.54) 7(-0.6,2.54) 8(-3.8,2.54)
SMD-4_L6.5-W4.6-P2.54-LS10.3-TL
  rect 2x1.5 smd: 1(-4.55,1.27) 2(-4.55,-1.27) 3(4.55,-1.27) 4(4.55,1.27)
SOD-123F_L2.8-W1.8-LS3.7-RD
  rect 1x1.2 smd: 1(-1.55,0) 2(1.55,0)
SOD-323_L1.8-W1.3-LS2.5-RD
  rect 1x0.75 smd: 1(-1.173,0) 2(1.173,0)
SOT-23-3_L3.0-W1.7-P0.95-LS2.9-BR
  rect 1.038x0.532 smd: 1(1.101,-0.95) 2(1.101,0.95) 3(-1.101,0)
SOT-223-3_L6.7-W3.7-P2.30-LS7.0-BR
  rect 2.34x0.98 smd: 1(2.87,-2.3) 2(2.87,0) 3(2.87,2.3)
  rect 2.34x3.6 smd: 4(-2.87,0)
Test-Point-0.5mm
  round 1 smd: 1(0,0)
TSSOP-14_L5.0-W4.4-P0.65-LS6.4-BL
  rect 0.4x1.7 smd: 1(-1.95,-2.8) 2(-1.3,-2.8) 3(-0.65,-2.8) 4(0,-2.8) 5(0.65,-2.8) 6(1.3,-2.8) 7(1.95,-2.8) 8(1.95,2.8) 9(1.3,2.8) 10(0.65,2.8) 11(0,2.8) 12(-0.65,2.8) 13(-1.3,2.8) 14(-1.95,2.8)

## Nets
As in the schematic, except:
SENSOR3: R41.2 TP5.1 TP12.1 U8.11 U10.8
SENSOR4: R1.2 TP2.1 TP13.1 U8.9 U10.7
$1N10678: R40.2 R46.1 R47.2 U8.10
$1N11010: R39.2 R48.1 R49.2 U8.8

Pads without a net: K1 2 5 6 7; P 2 4 6 13 15 16; P1 6 7 8 9; U5 4; U8 14; U12 1 2 3 4 5 6 7 8; U15 4

## Via types
v1: diameter 0.61, hole 0.305, Top Layer to Bottom Layer, 38 vias

## Routing (per net, layer and track width the routed paths; a pad name or vN(x,y) marks a point on that pad's centre or on a via; arc(x,y) is an arc through that point)
+3.3V: length 187.4
  Top Layer w0.254: 39.25,11.56 U5.2 ; v1(51.24,43.23) 51.3,43.23 R26.2 52.25,40.41 52.2,40.36 ; 38.03,42.09 R20.2
  Top Layer w0.5: v1(59.94,24.31) 59.91,24.31 59.91,25.46 59.3,26.06 58.11,26.06 56.82,24.77 56.82,23.09 57.31,22.6 59.44,22.6 60.47,21.58 60.47,20.36 61.64,19.18 65.19,19.18 66.09,18.29 R19.1 ; v1(38.1,32.43) 36.51,34.02 36.51,36.18 35.95,36.73 v1(34.64,36.73) ; v1(38.03,42.98) 38.03,41.27 ; v1(40.18,30.31) 41.17,29.32 41.64,29.32 41.69,29.27 41.69,27.56 R48.2 41.84,20.42 D8.2 39.25,13.08 C18.2 39.14,8.88 38.74,8.88 37.4,7.55 R10.2 36.67,7.55 C21.1 31.93,14.66 D9.1 ; R42.2 38.03,40.35 38.03,41.27 ; 38.03,41.27 38.1,41.19 40.19,41.19 40.68,41.68 42.5,41.68 42.51,41.68 ; R25.2 42.61,46.13 42.61,46.3 v1(42.54,46.37)
  Bottom Layer w0.5: 42.22,46.37 v1(42.54,46.37) ; 42.22,46.37 41.11,46.37 40.16,45.42 40.05,45.42 39.61,44.97 39.61,44.87 38,43.26 38,43.01 v1(38.03,42.98) 35.57,42.98 34.64,42.05 v1(34.64,36.73) 34.64,36.62 34.38,36.36 ; 42.22,46.37 42.24,46.35 42.52,46.35 v1(42.54,46.37) ; v1(42.54,46.37) 42.59,46.37 43.4,47.18 47.72,47.18 51.24,43.66 v1(51.24,43.23) ; v1(38.1,32.43) 40.18,30.35 v1(40.18,30.31) ; 64.58,25.59 64.58,28.24 63.31,29.51 63.31,33.71 62.51,34.51 61.68,34.51 ; P1.2 3.14,37.23 4.01,36.37 34.35,36.37 34.44,36.28 34.44,35.17 34.81,34.8 38.97,34.8 44.18,29.59 54.08,29.59 59.36,24.31 59.9,24.31 63.31,24.28 64.53,25.5
+5V: length 45.7
  Top Layer w0.254: D10.2 58.75,17.1 58.75,17.07 U15.2 54.19,9.52 C19.2 53.26,8.6 52.09,8.6 R52.2 48.92,8.55 C22.1 46.98,13.74 D11.1
  Top Layer w0.5: 58.75,17.1 57.72,18.14 57.72,19.17 56.04,20.84 56.04,26.34 60.21,30.5 60.21,35.97 U10.2
GND: length 276.9
  Top Layer w0.254: 67.91,13.77 67.83,13.69 LED1.2 ; 53.08,40.46 58.7,40.46 U10.5 ; 53.08,40.46 53.08,39.69 52.18,38.8 51.93,38.8 ; 53.08,40.46 53.08,43.16 C14.2 52.06,45.51 R36.1 ; 37.27,40.85 37.27,39.39 R43.1 ; 37.27,40.85 29.91,40.85 P.14 ; 37.27,40.85 37.27,43.34 C12.2 38.01,45.08 36.42,46.66 ; R40.1 53.83,36.9 R47.1 51.93,38.8 ; 40.13,24.19 39.43,23.49 39.43,22.34 40.12,21.64 ; 51.93,38.8 51.47,39.26 51.47,41.11 51.21,41.37 50.2,41.37 49.88,41.68 U8.12 ; 3.34,15.56 P1.13 ; 30.14,14.62 P.1
  Top Layer w0.5: 55.83,1.85 55.83,7.25 55.01,7.25 54.16,8.1 53.26,7.2 49.03,7.2 47.28,5.45 ; 55.83,1.85 54.82,0.83 45.17,0.83 41.68,4.33 C5.1 39.34,7.51 C18.1 38.49,6.83 32.04,6.83 C21.2 30.14,8.73 30.14,14.62 ; 55.83,1.85 55.83,1.47 56.09,1.22 58.37,1.22 60.91,3.76 CN2.1 ; R43.1 39.51,37.15 R33.1 R34.1 39.51,31.65 ; 45.95,18.41 46.63,18.41 R54.1 ; 45.95,18.41 45.95,19.56 LED2.2 47.15,19.76 51.66,19.76 51.83,19.94 51.83,19.97 51.88,20.02 51.88,24.96 49.91,26.93 49.91,32.05 50.72,32.86 50.72,33.22 ; 45.95,18.41 45.91,18.41 45.46,17.96 45.46,8.17 46.9,6.73 46.9,5.82 47.28,5.45 ; 47.28,5.45 C22.2 ; R12.1 34.73,23.74 34.73,27.73 34.37,28.09 ; R12.1 31.13,20.14 31.13,17.23 P.1 29.33,15.68 28.63,16.37 3.9,16.37 3.34,15.81 3.34,15.56 3.21,15.56 1.58,17.18 1.58,17.81 P1.11 1.71,20.8 1.71,37.94 P1.1 ; R12.1 39.43,23.49 ; LED1.2 64.12,11.65 60.71,11.65 57.12,8.06 C20.1 55.83,7.3 ; 50.72,33.22 R41.1 ; 50.72,33.22 51.44,33.22 52.29,34.08 ; 34.37,28.09 34.37,28.22 R45.1 37.73,29.8 39.51,31.58 39.51,31.65 ; 34.37,28.09 R56.1 ; 61.73,31.49 61.32,31.08 61.32,30.45 v1(59.53,28.65) ; 39.51,31.65 41.57,31.65 C15.2 ; 52.29,34.08 52.33,34.08 R49.1 57.24,30.43 v1(58,29.67) ; 52.29,34.08 R40.1 ; C13.2 47.84,45.14 52.06,45.14
  Bottom Layer w0.5: v1(58,29.67) 59.02,28.65 v1(59.53,28.65)
VCC: length 129.6
  Top Layer w0.254: v1(57.67,45.82) 57.51,45.82 TP9.1
  Top Layer w0.5: 68.02,21.27 65.84,23.45 58.9,23.45 58.46,23.89 U14.4 ; 68.02,21.27 68.45,20.84 68.48,20.84 68.48,17.91 67.91,17.35 67.86,17.35 ; 68.02,21.27 68.01,21.27 ; 68.02,21.27 68.45,21.27 69.79,22.61 69.79,25.54 K1.1 69.61,25.58 64.02,31.17 64.02,34.45 v1(64,34.47) ; v1(33.87,25.24) 33.87,27.42 R55.2 ; 69.79,22.71 69.79,22.41 71.29,20.91 71.29,17.4 71.33,17.37 71.33,13.93 65.96,8.56 61.43,8.56 CN2.2 60.91,6.93 57.25,3.27
  Bottom Layer w0.254: U10.1 66.56,45.32 66.56,46.33 66.05,46.84 58.68,46.84 v1(57.67,45.82)
  Bottom Layer w0.5: U10.1 61.62,40.49 61.14,40.01 61.14,39.11 60.28,38.24 60.28,38.06 60.24,38.02 60.24,36.75 61.01,35.99 62.36,35.99 63.89,34.47 v1(64,34.47) ; CN2.2 60.72,9.28 60.72,10.57 45.04,26.25 45.04,27.13 42.92,29.25 38.24,29.25 34.23,25.24 v1(33.87,25.24)
VCC_P: length 38.7
  Top Layer w0.254: 56.6,12.4 57.31,12.4 D10.1 ; 56.6,12.4 C20.2 ; 56.6,12.4 U15.3 ; D8.1 41.53,13.01 U5.3
  Top Layer w0.5: U5.3 41.53,9.06 C5.2 42.12,8.91 42.83,8.2 42.83,4.86 D6.1 46.68,1.86 50.48,5.66 54.18,5.66 54.68,6.16 v1(54.68,6.23) ; C20.2 56.58,9.46 56.14,9.02 v1(55.38,9.02)
  Bottom Layer w0.5: v1(55.38,9.02) 55.38,8.26 55.38,8.26 55.38,7.77 54.68,7.06 v1(54.68,6.23)
CAMARA_VCC: length 25.7
  Top Layer w0.5: v1(65.13,44.92) 64.82,44.92 64.82,46.15 TP14.1
  Bottom Layer w0.5: v1(65.13,44.92) 64.11,44.92 60.28,41.09 60.28,40.07 60.25,40.05 60.25,39.43 58.78,37.95 58.78,37.54 U10.6 58.96,37.26 58.96,36.7 60.25,35.41 60.25,29 60.29,28.97 60.29,28.34 60.25,28.31 60.25,27.48 K1.4
DIO1: length 10
  Top Layer w0.254: 32.83,31.14 31.13,32.84 31.13,33.63 P.11 ; 32.83,31.14 32.07,30.37 32.07,28.36 R55.1 ; 32.83,31.14 R56.2
DIO13: length 50.4
  Top Layer w0.254: v1(47.09,25.97) 46.19,25.07 46.19,23.84 R51.1
  Bottom Layer w0.254: v1(47.09,25.97) 38.82,34.23 4.27,34.23 P1.3
SENSOR1: length 54.1
  Top Layer w0.254: TP1.1 33.89,41.58 36.37,41.58 ; 41.45,38.02 41.45,34.93 R34.2 ; 41.45,38.02 v1(40.69,38.78) ; 41.45,38.02 42.51,39.08 ; 63.28,43.63 63.28,46.43 62.58,47.13 60.36,47.13 TP10.1 57.51,48.18 35.86,48.18 35.47,47.79 35.47,45.52 36.37,44.63 36.37,41.58 ; v1(36.39,41.58) 36.37,41.58
  Bottom Layer w0.254: v1(36.39,41.58) 39.18,38.78 v1(40.69,38.78)
SENSOR2: length 61.7
  Top Layer w0.254: TP6.1 33.92,44.24 v1(35.7,44.24) ; R36.2 48.15,46.78 v1(47.39,46.02) 46.33,47.07 v1(40.72,47.07) ; v1(53.09,44.1) 59.35,44.1 60.46,45.21 61.08,45.21 ; 42.51,40.38 42.56,40.43 v1(43.83,40.43) ; 61.08,45.21 TP11.1 ; 61.08,45.21 61.08,43.18 63.28,40.98 U10.9
  Bottom Layer w0.254: v1(35.7,44.24) 38.53,47.07 v1(40.72,47.07) ; 47.25,43.85 47.38,43.72 49,43.72 50.14,42.58 51.57,42.58 v1(53.09,44.1) ; 47.25,43.85 47.39,43.99 v1(47.39,46.02) ; 47.25,43.85 v1(43.83,40.43)
SENSOR3: length 54.8
  Top Layer w0.254: v1(65.78,46.04) 67.18,46.04 TP12.1 ; U8.11 46.9,41.03 45.33,39.46 v1(45.33,38.82) R41.2 ; v1(36.48,39.59) 33.77,39.59 TP5.1
  Bottom Layer w0.254: v1(36.48,39.59) 38,38.06 44.57,38.06 v1(45.33,38.82) 51.4,38.82 54.09,36.13 ; 54.09,36.13 54.09,37.91 62.22,46.04 v1(65.78,46.04) ; 54.09,36.13 58.73,31.49
SENSOR4: length 68.7
  Top Layer w0.254: v1(62.54,39.01) 62.42,38.89 61.15,38.89 60.25,37.99 60.25,36.72 58.73,35.2 U10.7 ; TP13.1 64.32,40.53 v1(64.06,40.53)
  Top Layer w0.5: 36.07,38.12 36.96,37.22 v1(38.23,37.22) ; 34.31,38.12 33.7,37.51 TP2.1 ; 49.6,37.71 49.54,37.77 49.54,39.4 49.21,39.72 48.68,39.72 ; U10.7 58.41,34.17 v1(53.92,34.17) ; v1(48.82,31.67) 48.87,31.62 48.87,29.37 44.7,25.2 44.7,22.85 43.49,21.64 R1.2 ; 36.08,38.16 34.32,38.16
  Bottom Layer w0.254: v1(62.54,39.01) v1(64.06,40.53)
  Bottom Layer w0.5: 53.12,33.51 53,33.51 52.29,34.22 52.29,36.71 51.58,37.42 49.54,37.42 ; v1(38.23,37.22) 43.78,31.67 v1(48.82,31.67) 51.42,31.67 v1(53.92,34.17)
  vias: v1(49.51,37.53)
SLEEP_RQ: length 79.2
  Top Layer w0.254: C12.1 39.57,43.92 39.57,43.63 ; 45.59,44.14 45.59,43.89 47.16,42.33 U8.13 50.39,42.33 ; 45.59,44.14 C13.1 ; 45.59,44.14 44.42,42.98 44.03,42.98 ; 50.39,42.33 50.39,43.61 C14.1 ; 50.39,42.33 50.7,42.33 R26.1 ; 43.1,31.29 43.64,31.82 43.64,36.74 44.54,37.64 44.54,42.47 44.03,42.98 ; 43.1,31.29 43.1,29.52 R30.1 43.27,29.04 v1(42.56,28.34) ; 43.1,31.29 C15.1 ; 44.03,42.98 42.51,42.98 ; 39.57,43.63 R20.1 ; 39.57,43.63 40.42,43.63 R25.1 ; 42.51,42.98 42.51,42.33 ; 42.51,42.98 41.14,44.34
  Bottom Layer w0.254: v1(42.56,28.34) 36.47,22.24 4.02,22.24 P1.10
$1N9776: length 9.4
  Top Layer w0.254: 40.16,39.73 40.16,39.25 R43.2 ; 40.16,39.73 R42.1 ; 40.16,39.73 43.51,39.73 43.74,39.5 43.74,37.72 R33.2
$1N10309: length 24.2
  Top Layer w0.254: 42.51,41.03 41.36,41.03 v1(41.16,40.82) ; v1(35.32,35.68) 35.06,35.42 35.06,34.02 35.95,33.13 35.95,31.31 ; v1(40.4,44.63) 39.38,45.65 R35.2
  Bottom Layer w0.254: 40.4,42.28 40.4,41.58 v1(41.16,40.82) ; 40.4,42.28 v1(40.4,44.63) ; 40.4,42.28 35.82,42.28 35.37,41.83 35.37,35.93 35.32,35.88 v1(35.32,35.68)
$1N10678: length 7.5
  Top Layer w0.254: U8.10 50.49,40.38 50.65,40.22 ; R46.1 50.65,40.31 50.65,40.22 ; 50.65,40.22 R47.2 50.87,38.35 50.87,35.61
$1N11010: length 26.1
  Top Layer w0.254: v1(47.59,30.37) 45.29,30.37 44.21,29.29 44.21,28.28 R48.1 43.08,27.15 R39.2 ; v1(53.43,30.37) 54.41,30.37 R49.2
  Top Layer w0.5: 47.64,30.32 47.64,32.92 46.76,33.81 46.76,37.24 48.41,38.89 48.41,39.07
  Bottom Layer w0.254: v1(47.59,30.37) v1(53.43,30.37)
$2N484: length 14.2
  Top Layer w0.254: 34.49,19.49 34.49,21.48 R12.2 ; 34.49,19.49 D9.2 ; 34.49,19.49 36.95,17.02 36.95,11.56 ; 36.95,11.56 U5.1 ; 36.95,11.56 36.95,8.41
$2N770: length 10.9
  Top Layer w0.254: R19.2 66.49,16.48 68.37,16.48 68.88,15.97 68.88,15.21 68.11,14.45 65.32,14.45 LED1.1
$2N3060: length 2.3
  Top Layer w0.254: U14.1 49.19,23.8 R51.2
$2N3062: length 2
  Top Layer w0.254: Q3.1 65.96,15.67
$2N3068: length 9.1
  Top Layer w0.254: R50.1 64.06,15.67 58.37,21.35
$2N3229: length 2.8
  Top Layer w0.254: LED2.1 48.76,21.86 49.27,21.35
$2N3351: length 6
  Top Layer w0.254: Q3.3 70.2,14.81 D7.2 69.75,17.8 K1.8
$2N4261: length 3.9
  Top Layer w0.254: F1.2 50.33,3.27 D6.2
$2N4985: length 9.6
  Top Layer w0.254: D11.2 48.46,14.68 49.82,14.68 ; R52.1 51.89,9.58 U15.1 51.89,12.62 49.82,14.68 ; 49.82,14.68 R53.2
$2N8186: length 2.8
  Top Layer w0.254: R53.1 49.78,16.76 R54.2
